# Altium schematic sheet finetunebox.SchDoc
size A; SheetNumber: 1; SheetTotal: 6
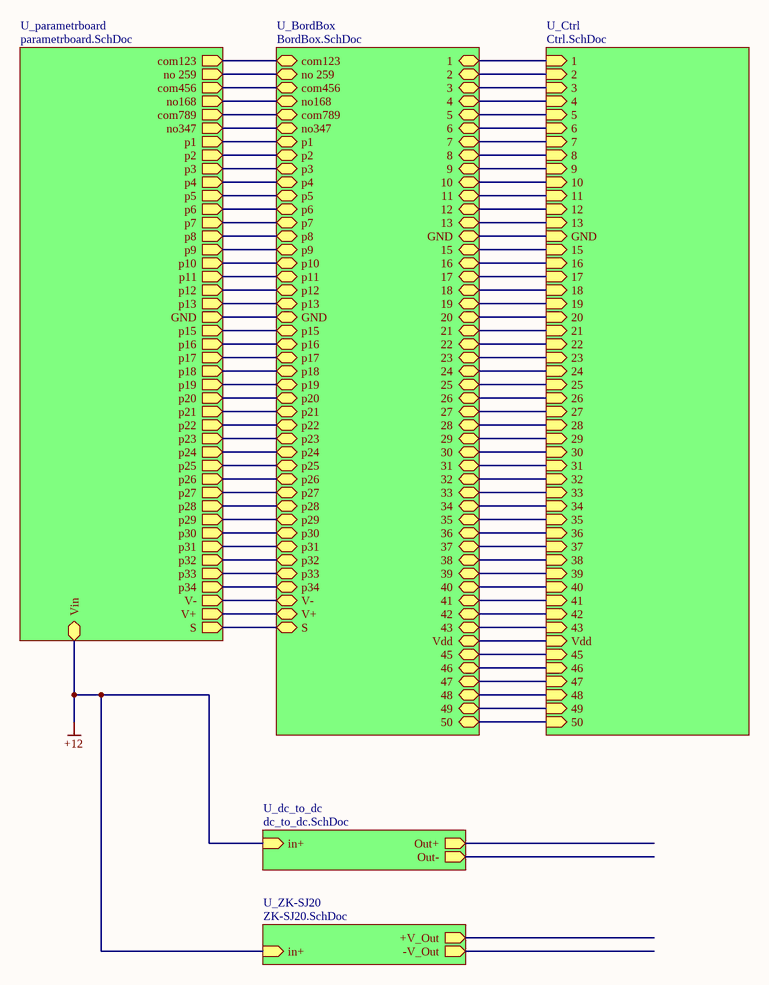
[diagram p0: finetunebox.SchDoc]

## Sub-sheets
U_BordBox = BordBox.SchDoc: com123 (bidir), no 259 (bidir), com456 (bidir), no168 (bidir), com789 (bidir), no347 (bidir), p1 (bidir), p2 (bidir), p3 (bidir), p4 (bidir), p5 (bidir), p6 (bidir), p7 (bidir), p8 (bidir), p9 (bidir), p34 (bidir), p33 (bidir), p32 (bidir), p31 (bidir), p30 (bidir), p29 (bidir), p28 (bidir), p27 (bidir), p26 (bidir), p25 (bidir), p24 (bidir), p23 (bidir), p22 (bidir), p21 (bidir), p20 (bidir), p19 (bidir), p18 (bidir), V- (bidir), V+ (bidir), S (bidir), p10 (bidir), p11 (bidir), p12 (bidir), p13 (bidir), p15 (bidir), p16 (bidir), p17 (bidir), 2 (bidir), 1 (bidir), 3 (bidir), 4 (bidir), 5 (bidir), 6 (bidir), 7 (bidir), 8 (bidir), 9 (bidir), 10 (bidir), 11 (bidir), 12 (bidir), 13 (bidir), 15 (bidir), 16 (bidir), 17 (bidir), 18 (bidir), 19 (bidir), 20 (bidir), 21 (bidir), 22 (bidir), 23 (bidir), 24 (bidir), 25 (bidir), 26 (bidir), 27 (bidir), 28 (bidir), 29 (bidir), 30 (bidir), 31 (bidir), 32 (bidir), 33 (bidir), 34 (bidir), 35 (bidir), 36 (bidir), 37 (bidir), 38 (bidir), 39 (bidir), 40 (bidir), 41 (bidir), 42 (bidir), 43 (bidir), 46 (bidir), 47 (bidir), 48 (bidir), 49 (bidir), 50 (bidir), Vdd (bidir), GND (bidir), 45 (bidir), GND (bidir)
U_Ctrl = Ctrl.SchDoc: 1 (in), 2 (in), 3 (in), 4 (in), 5 (in), 6 (in), 7 (in), 8 (in), 9 (in), 10 (in), 11 (in), 12 (in), 13 (in), 15 (in), 16 (in), 17 (in), 18 (in), 19 (in), 20 (in), 21 (in), 22 (in), 23 (in), 24 (in), 25 (in), 26 (in), 27 (in), 28 (in), 29 (in), 30 (in), 31 (in), 32 (in), 33 (in), 34 (in), 46 (in), 47 (in), 48 (in), 49 (in), 50 (in), 35 (in), 36 (in), 37 (in), 38 (in), 39 (in), 40 (in), 41 (in), 42 (in), 43 (in), Vdd (in), GND (in), 45 (in)
U_dc_to_dc = dc_to_dc.SchDoc: in+ (in), Out+ (out), Out- (out)
U_parametrboard = parametrboard.SchDoc: com123 (out), no 259 (out), com456 (out), no168 (out), com789 (out), no347 (out), p1 (out), p2 (out), p3 (out), p4 (out), p5 (out), p6 (out), p7 (out), p8 (out), p9 (out), p10 (out), p11 (out), p12 (out), p13 (out), p15 (out), p16 (out), p17 (out), p34 (out), p33 (out), p32 (out), p31 (out), p30 (out), p29 (out), p28 (out), p27 (out), p26 (out), p25 (out), p24 (out), p23 (out), p22 (out), p21 (out), p20 (out), p19 (out), p18 (out), V- (out), V+ (out), S (out), Vin (bidir), GND (out)
U_ZK-SJ20 = ZK-SJ20.SchDoc: +V_Out (out), -V_Out (out), in+ (in)

## Nets
+12: sheet U_parametrboard/Vin, sheet U_ZK-SJ20/in+, sheet U_dc_to_dc/in+
(unnamed): sheet U_parametrboard/com123, sheet U_BordBox/com123
(unnamed): sheet U_parametrboard/no 259, sheet U_BordBox/no 259
(unnamed): sheet U_parametrboard/com456, sheet U_BordBox/com456
(unnamed): sheet U_parametrboard/no168, sheet U_BordBox/no168
(unnamed): sheet U_parametrboard/com789, sheet U_BordBox/com789
(unnamed): sheet U_parametrboard/no347, sheet U_BordBox/no347
(unnamed): sheet U_parametrboard/p1, sheet U_BordBox/p1
(unnamed): sheet U_parametrboard/p2, sheet U_BordBox/p2
(unnamed): sheet U_parametrboard/p3, sheet U_BordBox/p3
(unnamed): sheet U_parametrboard/p4, sheet U_BordBox/p4
(unnamed): sheet U_parametrboard/p5, sheet U_BordBox/p5
(unnamed): sheet U_parametrboard/p6, sheet U_BordBox/p6
(unnamed): sheet U_parametrboard/p7, sheet U_BordBox/p7
(unnamed): sheet U_parametrboard/p8, sheet U_BordBox/p8
(unnamed): sheet U_parametrboard/p9, sheet U_BordBox/p9
(unnamed): sheet U_parametrboard/p10, sheet U_BordBox/p10
(unnamed): sheet U_parametrboard/p11, sheet U_BordBox/p11
(unnamed): sheet U_parametrboard/p12, sheet U_BordBox/p12
(unnamed): sheet U_parametrboard/p13, sheet U_BordBox/p13
(unnamed): sheet U_parametrboard/p15, sheet U_BordBox/p15
(unnamed): sheet U_parametrboard/p16, sheet U_BordBox/p16
(unnamed): sheet U_parametrboard/p17, sheet U_BordBox/p17
(unnamed): sheet U_parametrboard/p34, sheet U_BordBox/p34
(unnamed): sheet U_parametrboard/p33, sheet U_BordBox/p33
(unnamed): sheet U_parametrboard/p32, sheet U_BordBox/p32
(unnamed): sheet U_parametrboard/p31, sheet U_BordBox/p31
(unnamed): sheet U_parametrboard/p30, sheet U_BordBox/p30
(unnamed): sheet U_parametrboard/p29, sheet U_BordBox/p29
(unnamed): sheet U_parametrboard/p28, sheet U_BordBox/p28
(unnamed): sheet U_parametrboard/p27, sheet U_BordBox/p27
(unnamed): sheet U_parametrboard/p26, sheet U_BordBox/p26
(unnamed): sheet U_parametrboard/p25, sheet U_BordBox/p25
(unnamed): sheet U_parametrboard/p24, sheet U_BordBox/p24
(unnamed): sheet U_parametrboard/p23, sheet U_BordBox/p23
(unnamed): sheet U_parametrboard/p22, sheet U_BordBox/p22
(unnamed): sheet U_parametrboard/p21, sheet U_BordBox/p21
(unnamed): sheet U_parametrboard/p20, sheet U_BordBox/p20
(unnamed): sheet U_parametrboard/p19, sheet U_BordBox/p19
(unnamed): sheet U_parametrboard/p18, sheet U_BordBox/p18
(unnamed): sheet U_parametrboard/V-, sheet U_BordBox/V-
(unnamed): sheet U_parametrboard/V+, sheet U_BordBox/V+
(unnamed): sheet U_parametrboard/S, sheet U_BordBox/S
(unnamed): sheet U_parametrboard/GND, sheet U_BordBox/GND
(unnamed): sheet U_BordBox/2, sheet U_Ctrl/2
(unnamed): sheet U_BordBox/1, sheet U_Ctrl/1
(unnamed): sheet U_BordBox/3, sheet U_Ctrl/3
(unnamed): sheet U_BordBox/4, sheet U_Ctrl/4
(unnamed): sheet U_BordBox/5, sheet U_Ctrl/5
(unnamed): sheet U_BordBox/6, sheet U_Ctrl/6
(unnamed): sheet U_BordBox/7, sheet U_Ctrl/7
(unnamed): sheet U_BordBox/8, sheet U_Ctrl/8
(unnamed): sheet U_BordBox/9, sheet U_Ctrl/9
(unnamed): sheet U_BordBox/10, sheet U_Ctrl/10
(unnamed): sheet U_BordBox/11, sheet U_Ctrl/11
(unnamed): sheet U_BordBox/12, sheet U_Ctrl/12
(unnamed): sheet U_BordBox/13, sheet U_Ctrl/13
(unnamed): sheet U_BordBox/15, sheet U_Ctrl/15
(unnamed): sheet U_BordBox/16, sheet U_Ctrl/16
(unnamed): sheet U_BordBox/17, sheet U_Ctrl/17
(unnamed): sheet U_BordBox/18, sheet U_Ctrl/18
(unnamed): sheet U_BordBox/19, sheet U_Ctrl/19
(unnamed): sheet U_BordBox/20, sheet U_Ctrl/20
(unnamed): sheet U_BordBox/21, sheet U_Ctrl/21
(unnamed): sheet U_BordBox/22, sheet U_Ctrl/22
(unnamed): sheet U_BordBox/23, sheet U_Ctrl/23
(unnamed): sheet U_BordBox/24, sheet U_Ctrl/24
(unnamed): sheet U_BordBox/25, sheet U_Ctrl/25
(unnamed): sheet U_BordBox/26, sheet U_Ctrl/26
(unnamed): sheet U_BordBox/27, sheet U_Ctrl/27
(unnamed): sheet U_BordBox/28, sheet U_Ctrl/28
(unnamed): sheet U_BordBox/29, sheet U_Ctrl/29
(unnamed): sheet U_BordBox/30, sheet U_Ctrl/30
(unnamed): sheet U_BordBox/31, sheet U_Ctrl/31
(unnamed): sheet U_BordBox/32, sheet U_Ctrl/32
(unnamed): sheet U_BordBox/33, sheet U_Ctrl/33
(unnamed): sheet U_BordBox/34, sheet U_Ctrl/34
(unnamed): sheet U_BordBox/35, sheet U_Ctrl/35
(unnamed): sheet U_BordBox/36, sheet U_Ctrl/36
(unnamed): sheet U_BordBox/37, sheet U_Ctrl/37
(unnamed): sheet U_BordBox/38, sheet U_Ctrl/38
(unnamed): sheet U_BordBox/39, sheet U_Ctrl/39
(unnamed): sheet U_BordBox/40, sheet U_Ctrl/40
(unnamed): sheet U_BordBox/41, sheet U_Ctrl/41
(unnamed): sheet U_BordBox/42, sheet U_Ctrl/42
(unnamed): sheet U_BordBox/43, sheet U_Ctrl/43
(unnamed): sheet U_BordBox/46, sheet U_Ctrl/46
(unnamed): sheet U_BordBox/47, sheet U_Ctrl/47
(unnamed): sheet U_BordBox/48, sheet U_Ctrl/48
(unnamed): sheet U_BordBox/49, sheet U_Ctrl/49
(unnamed): sheet U_BordBox/50, sheet U_Ctrl/50
(unnamed): sheet U_BordBox/Vdd, sheet U_Ctrl/Vdd
(unnamed): sheet U_BordBox/45, sheet U_Ctrl/45
(unnamed): sheet U_BordBox/GND, sheet U_Ctrl/GND